# EAGLE board main (EAGLE 4.09), part 1 of 2
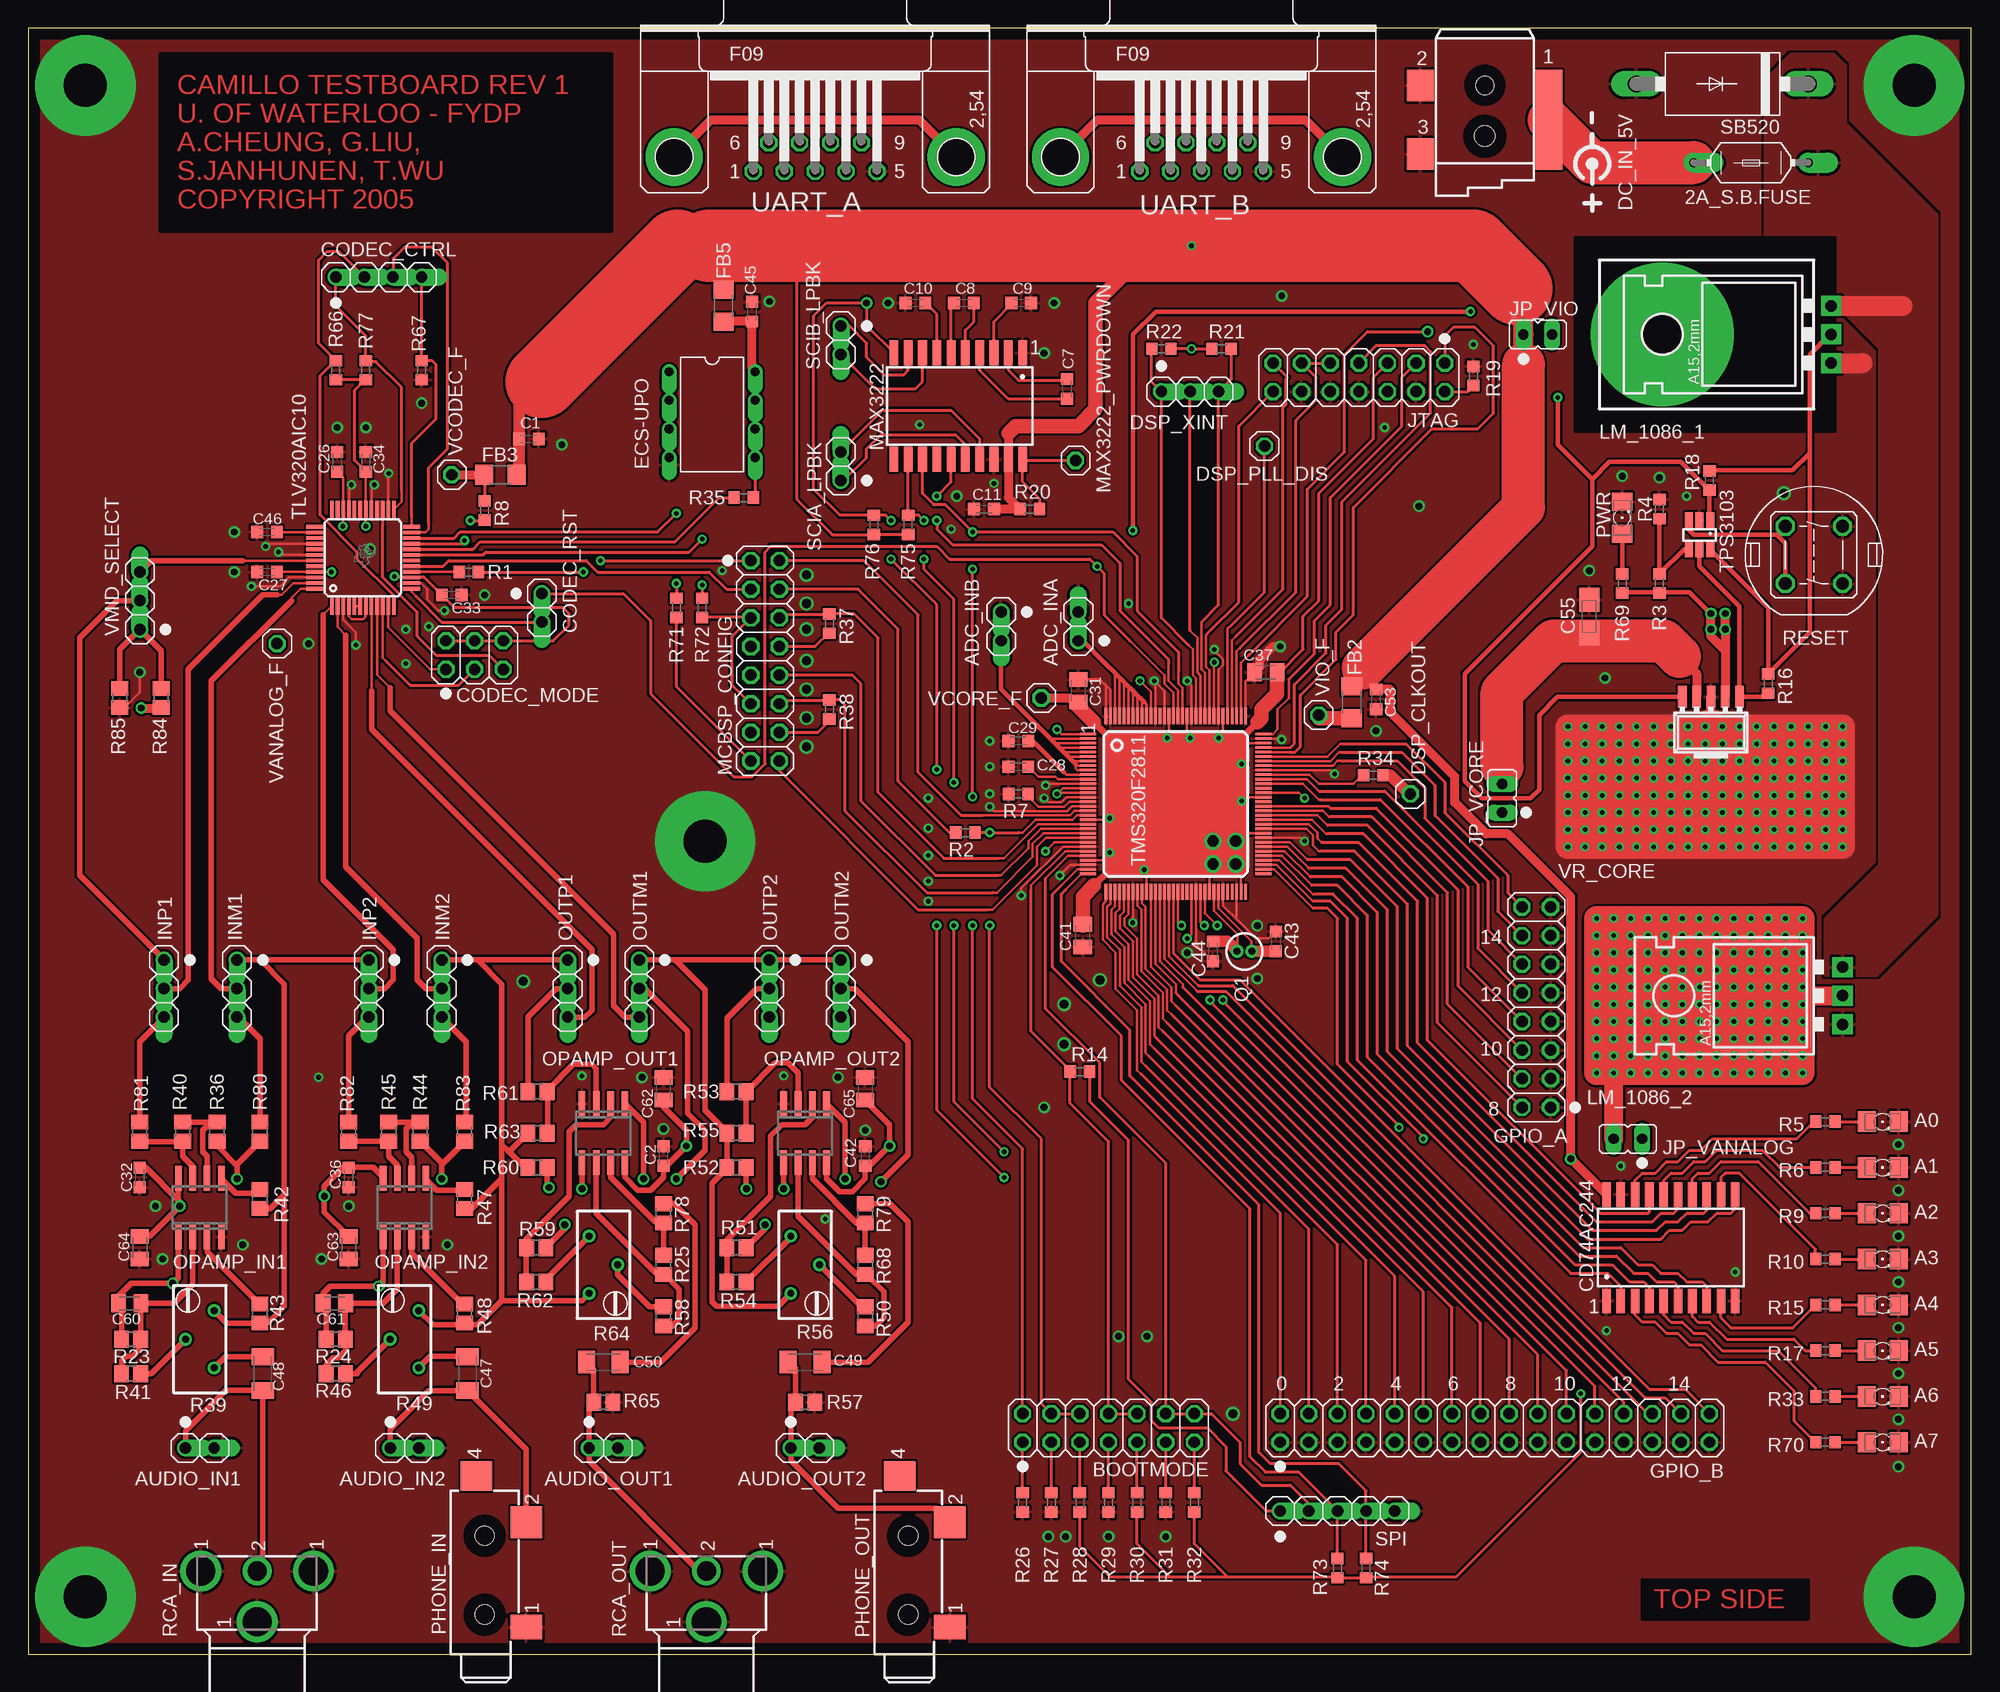
[diagram p8: board, top side]
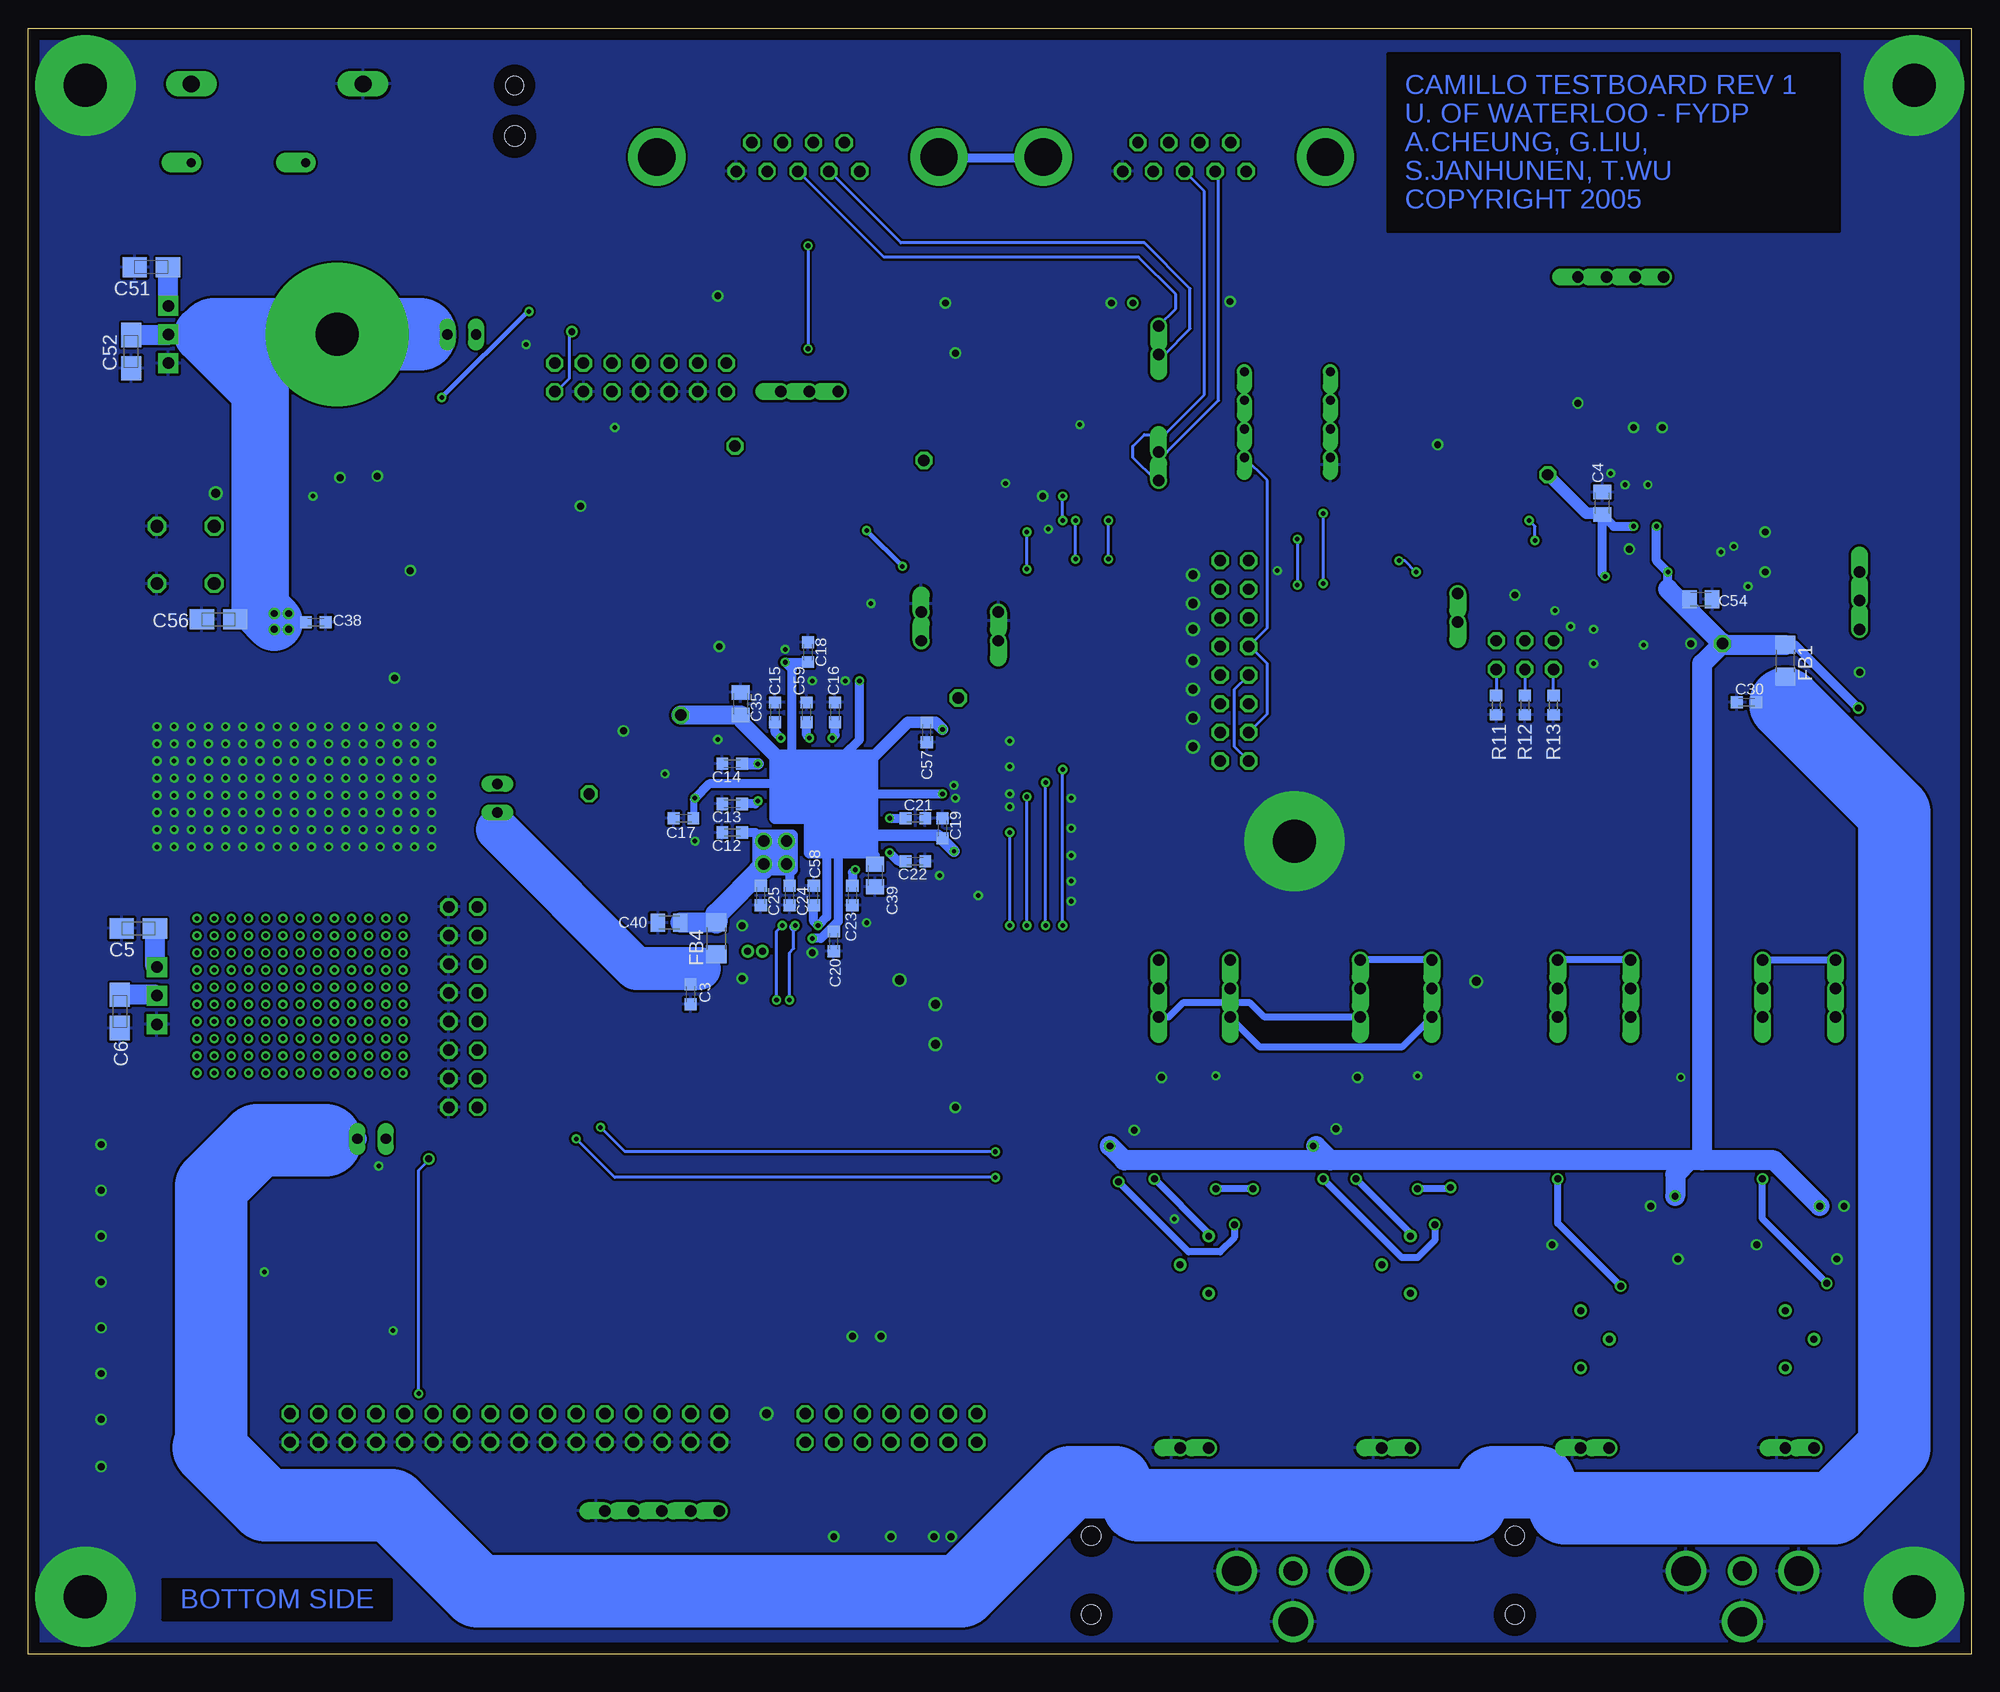
[diagram p9: board, bottom side, seen from below]

Size 172.47 x 144.27 mm. Coordinates in mm from the lower left corner, seen from the top.
Outline: 172.47,0 172.47,144.27 0,144.27 0,0 172.47,0
Copper layers used: Top, Bottom
tKeepout: area 0.6,0.6 to 9.5,9.5; area 162.9,0.6 to 171.9,9.6; area 162.9,134.7 to 171.8,143.6; area 0.6,134.7 to 9.5,143.6; area 55.6,67.7 to 64.5,76.6
bKeepout: area 0.6,0.6 to 9.5,9.5; area 162.9,0.6 to 171.8,9.5; area 0.6,134.7 to 9.5,143.6; area 162.9,134.7 to 171.8,143.6; area 55.6,67.7 to 64.5,76.6
tRestrict: 32 lines
bRestrict: 8 lines
vRestrict: area 0.6,0.6 to 9.5,9.5; area 162.9,0.6 to 171.9,9.6; area 162.9,134.7 to 171.8,143.6; area 0.6,134.7 to 9.5,143.6; area 55.6,67.7 to 64.5,76.6

## Footprints (pad centres in the part's own frame; a part is rotated, then mirrored left to right if it is on the bottom)
LITTLEFUSE = drill 0.813 pad 1.778 offset: 1 -5.08,0; 2 5.08,0
1206 = smd 1.6 x 1.803: A -1.422,0; C 1.422,0
1X02 = drill 1.016 offset: 1 -1.27,0; 2 1.27,0
2X07 = drill 1.016 octagon: 1 -7.62,-1.27; 2 -7.62,1.27; 3 -5.08,-1.27; 4 -5.08,1.27; 5 -2.54,-1.27; 6 -2.54,1.27; 7 0,-1.27; 8 0,1.27; 9 2.54,-1.27; 10 2.54,1.27; 11 5.08,-1.27; 12 5.08,1.27; 13 7.62,-1.27; 14 7.62,1.27
C0603K = smd 1.05 x 1.08: 1 -0.875,0; 2 0.875,0
C0805K = smd 1.3 x 1.6: 1 -1,0; 2 1,0
A/3216-18W = smd 2.15 x 1.8: + 1.475,0; - -1.475,0
C1206K = smd 1.5 x 2: 1 -1.5,0; 2 1.5,0
SO-20DW = smd 0.762 x 2.184: 1 -5.715,-4.727; 2 -4.445,-4.727; 3 -3.175,-4.727; 4 -1.905,-4.727; 5 -0.635,-4.727; 6 0.635,-4.727; 7 1.905,-4.727; 8 3.175,-4.727; 9 4.445,-4.727; 10 5.715,-4.727; 11 5.715,4.727; 12 4.445,4.727; 13 3.175,4.727; 14 1.905,4.727; 15 0.635,4.727; 16 -0.635,4.727; 17 -1.905,4.727; 18 -3.175,4.727; 19 -4.445,4.727; 20 -5.715,4.727
1X04 = drill 1.016 offset: 1 -3.81,0; 2 -1.27,0; 3 1.27,0; 4 3.81,0
2X03 = drill 1.016 octagon: 1 -2.54,-1.27; 2 -2.54,1.27; 3 0,-1.27; 4 0,1.27; 5 2.54,-1.27; 6 2.54,1.27
PJ-002A = smd 2.4 x 8.9: 1 -5.7,3.05 | smd 2.4 x 2.8: 2 5.7,0; 3 5.7,6.1 | hole 1.6: 0,0 | hole 1.8: 0,4.5
1X01 = drill 1.016 octagon: 1 0,0
1X03 = drill 1.016 offset: 1 -2.54,0; 2 0,0; 3 2.54,0
DIL08 = drill 0.813 offset: 1 -3.81,-3.81; 2 -1.27,-3.81; 3 1.27,-3.81; 4 3.81,-3.81; 5 3.81,3.81; 6 1.27,3.81; 7 -1.27,3.81; 8 -3.81,3.81
R1206 = smd 1.6 x 1.803: 1 -1.422,0; 2 1.422,0
2X08 = drill 1.016 octagon: 1 -8.89,-1.27; 2 -8.89,1.27; 3 -6.35,-1.27; 4 -6.35,1.27; 5 -3.81,-1.27; 6 -3.81,1.27; 7 -1.27,-1.27; 8 -1.27,1.27; 9 1.27,-1.27; 10 1.27,1.27; 11 3.81,-1.27; 12 3.81,1.27; 13 6.35,-1.27; 14 6.35,1.27; 15 8.89,-1.27; 16 8.89,1.27
2X16 = drill 1.016 octagon: 1 -19.05,-1.27; 2 -19.05,1.27; 3 -16.51,-1.27; 4 -16.51,1.27; 5 -13.97,-1.27; 6 -13.97,1.27; 7 -11.43,-1.27; 8 -11.43,1.27; 9 -8.89,-1.27; 10 -8.89,1.27; 11 -6.35,-1.27; 12 -6.35,1.27; 13 -3.81,-1.27; 14 -3.81,1.27; 15 -1.27,-1.27; 16 -1.27,1.27; 17 1.27,-1.27; 18 1.27,1.27; 19 3.81,-1.27; 20 3.81,1.27; 21 6.35,-1.27; 22 6.35,1.27; 23 8.89,-1.27; 24 8.89,1.27; 25 11.43,-1.27; 26 11.43,1.27; 27 13.97,-1.27; 28 13.97,1.27; 29 16.51,-1.27; 30 16.51,1.27; 31 19.05,-1.27; 32 19.05,1.27
JP1 = drill 0.914 long: 1 0,-1.27; 2 0,1.27
TO220_HSINK = drill 1.016 pad 1.778 square: 1 -2.54,-3.81; 2 0,-3.81; 3 2.54,-3.81
SO08 = smd 0.6 x 2.2: 1 -1.905,-2.6; 2 -0.635,-2.6; 3 0.635,-2.6; 4 1.905,-2.6; 5 1.905,2.6; 6 0.635,2.6; 7 -0.635,2.6; 8 -1.905,2.6
MJ-3523-SMT = smd 2.2 x 2.8: 1 -2.4,3.7 | smd 2.8 x 2.8: 2 -11.7,3.7 | smd 2.6 x 2.8: 4 -15.8,-0.75 | hole 1.7: -3.5,0; -10.5,0
CSA-309 = drill 0.62 round: P$1 -0.65,0; P$2 0.65,0
R0603 = smd 1 x 1.1: 1 -0.85,0; 2 0.85,0
R0805 = smd 1.3 x 1.5: 1 -0.85,0; 2 0.85,0
RTRIMT93YB = drill 0.61 round: 1 1.27,-2.54; 2 -1.27,0; 3 1.27,2.54
RCJ-013 = drill 2.6 round: SHLD_A 0,5; SHLD_B 4.5,0; SHLD_C 0,-5 | drill 1.7 round: TIP 0,0
DTE6 = drill 1.118 octagon: 1 -2.54,2.54; 2 2.54,2.54; 3 2.54,-2.54; 4 -2.54,-2.54
DO201-15 = drill 1.499 long: A 7.62,0; C -7.62,0
1X05 = drill 1.016 offset: 1 -5.08,0; 2 -2.54,0; 3 0,0; 4 2.54,0; 5 5.08,0
PQFP48 = smd 1.5 x 0.33: 1 -4.3,2.75; 2 -4.3,2.25; 3 -4.3,1.75; 4 -4.3,1.25; 5 -4.3,0.75; 6 -4.3,0.25; 7 -4.3,-0.25; 8 -4.3,-0.75; 9 -4.3,-1.25; 10 -4.3,-1.75; 11 -4.3,-2.25; 12 -4.3,-2.75; 25 4.3,-2.75; 26 4.3,-2.25; 27 4.3,-1.75; 28 4.3,-1.25; 29 4.3,-0.75; 30 4.3,-0.25; 31 4.3,0.25; 32 4.3,0.75; 33 4.3,1.25; 34 4.3,1.75; 35 4.3,2.25; 36 4.3,2.75 | smd 0.33 x 1.5: 13 -2.75,-4.3; 14 -2.25,-4.3; 15 -1.75,-4.3; 16 -1.25,-4.3; 17 -0.75,-4.3; 18 -0.25,-4.3; 19 0.25,-4.3; 20 0.75,-4.3; 21 1.25,-4.3; 22 1.75,-4.3; 23 2.25,-4.3; 24 2.75,-4.3; 37 2.75,4.3; 38 2.25,4.3; 39 1.75,4.3; 40 1.25,4.3; 41 0.75,4.3; 42 0.25,4.3; 43 -0.25,4.3; 44 -0.75,4.3; 45 -1.25,4.3; 46 -1.75,4.3; 47 -2.25,4.3; 48 -2.75,4.3
PQFPG128 = smd 0.245 x 1.422: P$1 -6.2,-7.8; P$2 -5.8,-7.8; P$3 -5.4,-7.8; P$4 -5,-7.8; P$5 -4.6,-7.8; P$6 -4.2,-7.8; P$7 -3.8,-7.8; P$8 -3.4,-7.8; P$9 -3,-7.8; P$10 -2.6,-7.8; P$11 -2.2,-7.8; P$12 -1.8,-7.8; P$13 -1.4,-7.8; P$14 -1,-7.8; P$15 -0.6,-7.8; P$16 -0.2,-7.8; P$17 0.2,-7.8; P$18 0.6,-7.8; P$19 1,-7.8; P$20 1.4,-7.8; P$21 1.8,-7.8; P$22 2.2,-7.8; P$23 2.6,-7.8; P$24 3,-7.8; P$25 3.4,-7.8; P$26 3.8,-7.8; P$27 4.2,-7.8; P$28 4.6,-7.8; P$29 5,-7.8; P$30 5.4,-7.8; P$31 5.8,-7.8; P$32 6.2,-7.8; P$65 6.2,7.8; P$66 5.8,7.8; P$67 5.4,7.8; P$68 5,7.8; P$69 4.6,7.8; P$70 4.2,7.8; P$71 3.8,7.8; P$72 3.4,7.8; P$73 3,7.8; P$74 2.6,7.8; P$75 2.2,7.8; P$76 1.8,7.8; P$77 1.4,7.8; P$78 1,7.8; P$79 0.6,7.8; P$80 0.2,7.8; P$81 -0.2,7.8; P$82 -0.6,7.8; P$83 -1,7.8; P$84 -1.4,7.8; P$85 -1.8,7.8; P$86 -2.2,7.8; P$87 -2.6,7.8; P$88 -3,7.8; P$89 -3.4,7.8; P$90 -3.8,7.8; P$91 -4.2,7.8; P$92 -4.6,7.8; P$93 -5,7.8; P$94 -5.4,7.8; P$95 -5.8,7.8; P$96 -6.2,7.8 | smd 1.422 x 0.245: P$33 7.8,-6.2; P$34 7.8,-5.8; P$35 7.8,-5.4; P$36 7.8,-5; P$37 7.8,-4.6; P$38 7.8,-4.2; P$39 7.8,-3.8; P$40 7.8,-3.4; P$41 7.8,-3; P$42 7.8,-2.6; P$43 7.8,-2.2; P$44 7.8,-1.8; P$45 7.8,-1.4; P$46 7.8,-1; P$47 7.8,-0.6; P$48 7.8,-0.2; P$49 7.8,0.2; P$50 7.8,0.6; P$51 7.8,1; P$52 7.8,1.4; P$53 7.8,1.8; P$54 7.8,2.2; P$55 7.8,2.6; P$56 7.8,3; P$57 7.8,3.4; P$58 7.8,3.8; P$59 7.8,4.2; P$60 7.8,4.6; P$61 7.8,5; P$62 7.8,5.4; P$63 7.8,5.8; P$64 7.8,6.2; P$97 -7.8,6.2; P$98 -7.8,5.8; P$99 -7.8,5.4; P$100 -7.8,5; P$101 -7.8,4.6; P$102 -7.8,4.2; P$103 -7.8,3.8; P$104 -7.8,3.4; P$105 -7.8,3; P$106 -7.8,2.6; P$107 -7.8,2.2; P$108 -7.8,1.8; P$109 -7.8,1.4; P$110 -7.8,1; P$111 -7.8,0.6; P$112 -7.8,0.2; P$113 -7.8,-0.2; P$114 -7.8,-0.6; P$115 -7.8,-1; P$116 -7.8,-1.4; P$117 -7.8,-1.8; P$118 -7.8,-2.2; P$119 -7.8,-2.6; P$120 -7.8,-3; P$121 -7.8,-3.4; P$122 -7.8,-3.8; P$123 -7.8,-4.2; P$124 -7.8,-4.6; P$125 -7.8,-5; P$126 -7.8,-5.4; P$127 -7.8,-5.8; P$128 -7.8,-6.2
SO-06 = smd 0.7 x 1.35: P$1 -0.95,-1.32; P$2 0,-1.32; P$3 0.95,-1.32; P$4 0.95,1.32; P$5 0,1.32; P$6 -0.95,1.32
F09HP = drill 1.016 octagon: 1 -5.486,-1.27; 2 -2.743,-1.27; 3 0,-1.27; 4 2.743,-1.27; 5 5.486,-1.27; 6 -4.115,1.27; 7 -1.372,1.27; 8 1.372,1.27; 9 4.115,1.27 | drill 3.302 pad 5.08 round: G1 -12.522,0; G2 12.522,0
SOT223-5 = smd 0.762 x 1.93: 1 -2.54,-3.15; 2 -1.27,-3.15; 3 0,-3.15; 4 1.27,-3.15; 5 2.54,-3.15

## Placement (x,y rotation side)
2A_S.B.FUSE  [LITTLEFUSE]  152.91,132.33 0 top
A0  [1206]  164.59,47.24 0 top
A1  [1206]  164.59,43.18 0 top
A2  [1206]  164.59,39.12 0 top
A3  [1206]  164.59,35.05 0 top
A4  [1206]  164.59,30.99 0 top
A5  [1206]  164.59,26.92 0 top
A6  [1206]  164.59,22.86 0 top
A7  [1206]  164.59,18.8 0 top
ADC_INA  [1X02]  93.22,91.19 90 top
ADC_INB  [1X02]  86.36,91.19 270 top
AUDIO_IN1  [1X02]  15.24,18.29 0 top
AUDIO_IN2  [1X02]  33.4,18.29 0 top
AUDIO_OUT1  [1X02]  51.05,18.29 0 top
AUDIO_OUT2  [1X02]  68.96,18.29 0 top
BOOTMODE  [2X07]  95.89,20.07 0 top
C1  0.1uF  [C0603K]  44.45,107.82 0 top
C2  0.1uF  [C0603K]  56.39,44.2 90 top
C3  0.1uF  [C0603K]  113.67,58.55 270 bottom
C4  2.2uF  [C0805K]  32.77,102.11 90 bottom
C5  10uF  [A/3216-18W]  162.69,64.39 0 bottom
C6  10uF  [A/3216-18W]  164.34,57.02 90 bottom
C7  0.1uF  [C0603K]  92.2,112.27 270 top
C8  0.1uF  [C0603K]  83.06,119.89 180 top
C9  0.1uF  [C0603K]  88.14,119.89 0 top
C10  0.1uF  [C0603K]  78.74,119.89 180 top
C11  0.1uF  [C0603K]  84.84,101.6 180 top
C12  0.1uF  [C0603K]  109.98,72.9 180 bottom
C13  0.1uF  [C0603K]  109.98,75.44 180 bottom
C14  0.1uF  [C0603K]  109.98,78.99 180 bottom
C15  0.1uF  [C0603K]  106.17,83.57 90 bottom
C16  0.1uF  [C0603K]  100.84,83.57 90 bottom
C17  0.1uF  [C0603K]  114.3,74.17 180 bottom
C18  0.1uF  [C0603K]  103.25,88.9 90 bottom
C19  0.1uF  [C0603K]  91.31,73.28 90 bottom
C20  0.1uF  [C0603K]  100.97,63.25 270 bottom
C21  0.1uF  [C0603K]  93.73,74.17 0 bottom
C22  0.1uF  [C0603K]  93.73,70.36 0 bottom
C23  0.1uF  [C0603K]  99.31,67.31 270 bottom
C24  0.1uF  [C0603K]  104.9,67.31 270 bottom
C25  0.1uF  [C0603K]  107.44,67.31 270 bottom
C26  0.1uF  [C0603K]  27.43,105.79 90 top
C27  0.1uF  [C0603K]  21.21,96.01 180 top
C28  0.1uF  [C0603K]  87.88,78.74 180 top
C29  0.1uF  [C0603K]  87.88,81.03 180 top
C30  0.1uF  [C0603K]  19.94,84.45 180 bottom
C31  2.2uF  [C0805K]  93.22,85.47 90 top
C32  0.1uF  [C0603K]  9.91,42.29 270 top
C33  0.1uF  [C0603K]  37.59,93.98 0 top
C34  0.1uF  [C0603K]  29.97,105.79 90 top
C35  2.2uF  [C0805K]  109.22,84.33 90 bottom
C36  0.1uF  [C0603K]  28.45,42.29 270 top
C37  2.2uF  [C0805K]  109.86,87.12 180 top
C38  2.2uF  [C0603K]  146.94,91.57 0 bottom
C39  2.2uF  [C0805K]  97.28,69.09 270 bottom
C40  2.2uF  [C0805K]  115.57,64.9 180 bottom
C41  2.2uF  [C0805K]  93.6,63.75 270 top
C42  0.1uF  [C0603K]  74.3,44.2 90 top
C43  26pF  [C0603K]  110.74,63.25 90 top
C44  26pF  [C0603K]  105.16,62.36 270 top
C45  0.1uF  [C0603K]  64.26,119.13 90 top
C46  0.1uF  [C0603K]  21.21,99.57 180 top
C47  10uF  [C1206K]  38.99,24.89 90 top
C48  10uF  [C1206K]  20.83,24.89 90 top
C49  10uF  [C1206K]  68.96,25.91 180 top
C50  10uF  [C1206K]  51.05,25.91 180 top
C51  10uF  [A/3216-18W]  161.54,123.06 0 bottom
C52  10uF  [A/3216-18W]  163.32,115.57 90 bottom
C53  0.1uF  [C0603K]  119.63,84.71 270 top
C54  2.2uF  [C0805K]  24,93.6 0 bottom
C55  10uF  [A/3216-18W]  138.56,92.08 270 top
C56  22uF  [A/3216-18W]  155.57,91.82 0 bottom
C57  0.1uF  [C0603K]  92.71,81.79 270 bottom
C58  0.1uF  [C0603K]  102.74,67.31 90 bottom
C59  0.1uF  [C0603K]  103.38,83.57 90 bottom
C60  120pF  [C0805K]  9.02,31.11 180 top
C61  120pF  [C0805K]  27.18,31.11 180 top
C62  1uF  [C0805K]  56.39,50.16 90 top
C63  1uF  [C0805K]  28.45,36.07 270 top
C64  1uF  [C0805K]  9.91,36.07 270 top
C65  1uF  [C0805K]  74.3,50.16 90 top
CD74AC244  CD74AC244  [SO-20DW]  145.8,36.07 0 top
CODEC_CTRL  [1X04]  31.11,122.17 0 top
CODEC_MODE  [2X03]  39.62,88.65 0 top
CODEC_RST  [1X02]  45.59,92.84 270 top
DC_IN_5V  PJ-002A  [PJ-002A]  129.29,139.19 180 top
DSP_CLKOUT  [1X01]  122.68,76.33 270 top
DSP_PLL_DIS  [1X01]  109.73,107.19 180 top
DSP_XINT  [1X03]  103.12,112.01 0 top
ECS-UPO  8.192 MHz  [DIL08]  60.71,109.98 270 top
FB1  600  [R1206]  16.51,88.14 90 bottom
FB2  600  [R1206]  117.47,84.45 270 top
FB3  600  [R1206]  41.91,104.65 180 top
FB4  600  [R1206]  111.38,63.5 90 bottom
FB5  600  [R1206]  61.72,119.63 90 top
GPIO_A  [2X08]  133.86,57.4 90 top
GPIO_B  [2X16]  130.18,20.07 0 top
INM1  [1X03]  18.54,59.05 270 top
INM2  [1X03]  36.7,59.05 270 top
INP1  [1X03]  12.06,59.05 270 top
INP2  [1X03]  30.23,59.05 270 top
JP_VANALOG  [JP1]  141.99,45.72 90 top
JP_VCORE  [JP1]  130.81,75.95 0 top
JP_VIO  [JP1]  133.99,117.09 270 top
JTAG  [2X07]  118.11,113.28 180 top
LM_1086_1  LM1086IT  [TO220_HSINK]  156.21,117.09 90 top
LM_1086_2  LM1086IT  [TO220_HSINK]  157.23,58.42 90 top
MAX3222  MAX3222  [SO-20DW]  82.55,110.74 180 top
MAX3222_PWRDOWN  [1X01]  92.96,105.92 0 top
MCBSP_CONFIG  [2X08]  65.41,88.14 270 top
OPAMP_IN1  [SO08]  15.24,39.62 0 top
OPAMP_IN2  [SO08]  33.4,39.62 0 top
OPAMP_OUT1  [SO08]  51.05,46.23 180 top
OPAMP_OUT2  [SO08]  68.96,46.23 180 top
OUTM1  [1X03]  54.23,59.05 270 top
OUTM2  [1X03]  72.14,59.05 270 top
OUTP1  [1X03]  47.88,59.05 270 top
OUTP2  [1X03]  65.79,59.05 270 top
PHONE_IN  MJ-3523-SMT  [MJ-3523-SMT]  40.51,0 270 top
PHONE_OUT  MJ-3523-SMT  [MJ-3523-SMT]  78.11,0 270 top
PWR  [1206]  141.48,100.84 90 top
Q1  27 MHz  [CSA-309]  107.95,62.36 0 top
R1  100  [R0603]  39.12,96.01 180 top
R2  100  [R0603]  83.19,72.9 0 top
R3  38.3K  [R0603]  144.78,95 90 top
R4  11.0K  [R0603]  144.78,101.6 90 top
R5  120  [R0603]  159.51,47.24 0 top
R6  120  [R0603]  159.51,43.18 0 top
R7  24.9K  [R0603]  87.88,76.33 0 top
R8  10K  [R0603]  40.51,101.47 90 top
R9  120  [R0603]  159.51,39.12 0 top
R10  120  [R0603]  159.51,35.05 0 top
R11  10K  [R0603]  42.16,84.2 270 bottom
R12  10K  [R0603]  39.62,84.2 270 bottom
R13  10K  [R0603]  37.08,84.2 270 bottom
R14  100  [R0603]  93.34,51.69 180 top
R15  120  [R0603]  159.51,30.99 0 top
R16  5K  [R0603]  154.43,86.11 90 top
R17  120  [R0603]  159.51,26.92 0 top
R18  5K  [R0603]  149.22,104.14 90 top
R19  2.2K  [R0603]  128.27,113.41 270 top
R20  10K  [R0603]  88.9,101.6 180 top
R21  10K  [R0603]  105.92,115.82 180 top
R22  10K  [R0603]  100.58,115.82 0 top
R23  200K  [R0805]  9.14,27.94 180 top
R24  200K  [R0805]  27.3,27.94 180 top
R25  10K  [R0805]  56.39,34.54 90 top
R26  3.3K  [R0603]  88.27,13.46 270 top
R27  10K  [R0603]  90.81,13.46 270 top
R28  10K  [R0603]  93.34,13.46 270 top
R29  10K  [R0603]  95.89,13.46 270 top
R30  10K  [R0603]  98.42,13.46 270 top
R31  10K  [R0603]  100.97,13.46 270 top
R32  10K  [R0603]  103.5,13.46 270 top
R33  120  [R0603]  159.51,22.86 0 top
R34  50  [R0603]  119.38,77.98 180 top
R35  100  [R0603]  63.5,102.62 180 top
R36  10K  [R0805]  16.76,46.35 90 top
R37  100  [R0603]  71.12,91.44 90 top
R38  100  [R0603]  71.12,83.82 90 top
R39  250K  [RTRIMT93YB]  15.24,27.94 0 top
R40  10K  [R0805]  13.72,46.35 270 top
R41  10K  [R0805]  9.14,24.89 180 top
R42  5K  [R0805]  20.57,40.39 90 top
R43  10K  [R0805]  20.57,30.23 90 top
R44  10K  [R0805]  34.8,46.35 90 top
R45  10K  [R0805]  32,46.35 270 top
R46  10K  [R0805]  27.3,24.89 180 top
R47  5K  [R0805]  38.73,40.39 90 top
R48  10K  [R0805]  38.73,30.23 90 top
R49  250K  [RTRIMT93YB]  33.4,27.94 0 top
R50  10K  [R0805]  74.3,29.97 270 top
R51  10K  [R0805]  62.87,36.07 180 top
R52  5K  [R0805]  62.87,43.18 0 top
R53  10K  [R0805]  62.87,49.91 0 top
R54  10K  [R0805]  62.87,33.02 0 top
R55  10K  [R0805]  62.87,46.23 0 top
R56  250K  [RTRIMT93YB]  68.96,34.54 180 top
R57  50K  [R0805]  68.96,22.35 180 top
R58  10K  [R0805]  56.39,29.97 270 top
R59  10K  [R0805]  45.09,36.07 180 top
R60  5K  [R0805]  45.21,43.18 0 top
R61  10K  [R0805]  45.21,49.91 0 top
R62  10K  [R0805]  45.09,33.02 0 top
R63  10K  [R0805]  45.21,46.23 0 top
R64  250K  [RTRIMT93YB]  51.05,34.54 180 top
R65  50K  [R0805]  51.05,22.35 180 top
R66  10K  [R0603]  27.3,113.92 270 top
R67  10K  [R0603]  34.92,113.92 90 top
R68  10K  [R0805]  74.3,34.54 90 top
R69  120  [R0603]  141.48,95 270 top
R70  120  [R0603]  159.51,18.8 0 top
R71  100  [R0603]  57.53,92.84 270 top
R72  100  [R0603]  59.82,92.84 270 top
R73  10K  [R0603]  116.2,7.62 270 top
R74  10K  [R0603]  118.75,7.62 270 top
R75  10K  [R0603]  78.11,100.2 270 top
R76  10K  [R0603]  75.06,100.2 270 top
R77  10K  [R0603]  29.97,113.92 270 top
R78  470  [R0805]  56.39,39.12 90 top
R79  470  [R0805]  74.3,39.12 90 top
R80  470  [R0805]  20.57,46.35 90 top
R81  470  [R0805]  9.91,46.35 90 top
R82  470  [R0805]  28.45,46.35 90 top
R83  470  [R0805]  38.73,46.35 90 top
R84  10K  [R0805]  11.81,84.84 270 top
R85  10K  [R0805]  8.13,84.84 90 top
RCA_IN  RCJ-013  [RCJ-013]  20.32,7.37 270 top
RCA_OUT  RCJ-013  [RCJ-013]  60.2,7.37 270 top
RESET  DTE6  [DTE6]  158.5,97.54 90 top
SB520  SB320  [DO201-15]  150.37,139.32 180 top
SCIA_LPBK  [1X02]  72.14,105.41 90 top
SCIB_LPBK  [1X02]  72.14,116.59 270 top
SPI  [1X05]  116.2,12.7 0 top
TLV320AIC10  TLV320AIC10  [PQFP48]  29.72,97.28 90 top
TMS320F2811  [PQFPG128]  101.85,75.44 270 top
TPS3103  TPS3103  [SO-06]  148.34,99.31 180 top
UART_A  [F09HP]  69.85,132.84 0 top
UART_B  [F09HP]  104.14,132.84 0 top
VANALOG_F  [1X01]  22.1,89.66 90 top
VCODEC_F  [1X01]  37.59,104.65 90 top
VCORE_F  [1X01]  89.92,84.84 90 top
VIO_F  [1X01]  114.55,83.31 270 top
VMID_SELECT  [1X03]  9.91,93.47 90 top
VR_CORE  TPS72518DCQR  [SOT223-5]  149.35,81.79 180 top